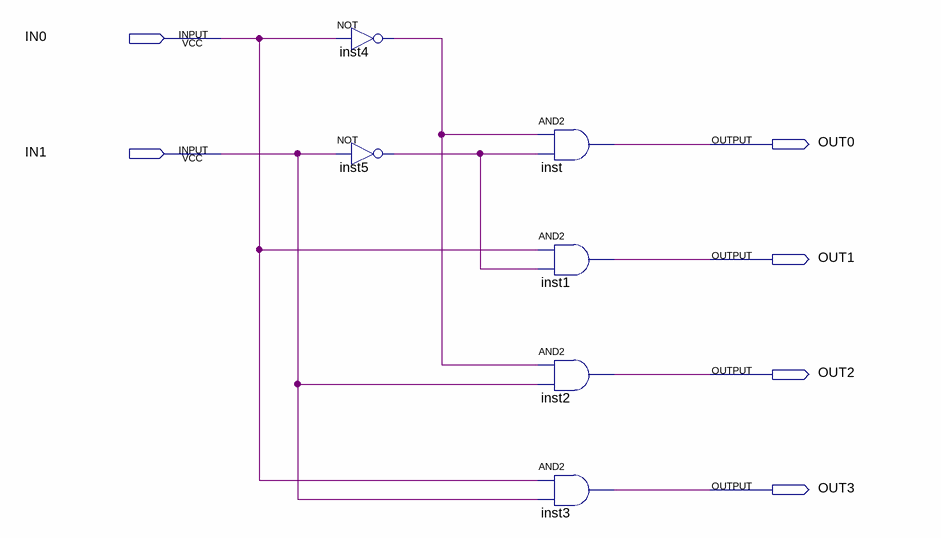
[diagram p0: schematic sheet]
// Quartus schematic DecoderGrafico.bdf as structural Verilog: 6 symbols, 6 pins
module DecoderGrafico (
  input  IN0,
  input  IN1,
  output OUT0,
  output OUT1,
  output OUT2,
  output OUT3
);

  wire inst4_out, inst5_out;

  not inst4 (inst4_out, IN0);
  not inst5 (inst5_out, IN1);
  and inst (OUT0, inst4_out, inst5_out);
  and inst1 (OUT1, IN0, inst5_out);
  and inst2 (OUT2, inst4_out, IN1);
  and inst3 (OUT3, IN0, IN1);
endmodule
